# EasyEDA Pro project ProPrj_TBHandheld_2025-05-05.epro

# Schematic Schematic1
Board Name: Board1; Create Date: 2025-03-19; Page Name: P1; Project Name: ESP8266 Console; Schematic Name: Schematic1; Update Date: 2025-03-19; Company: EasyEDA.com; Page Size: A4; Version: V1.0
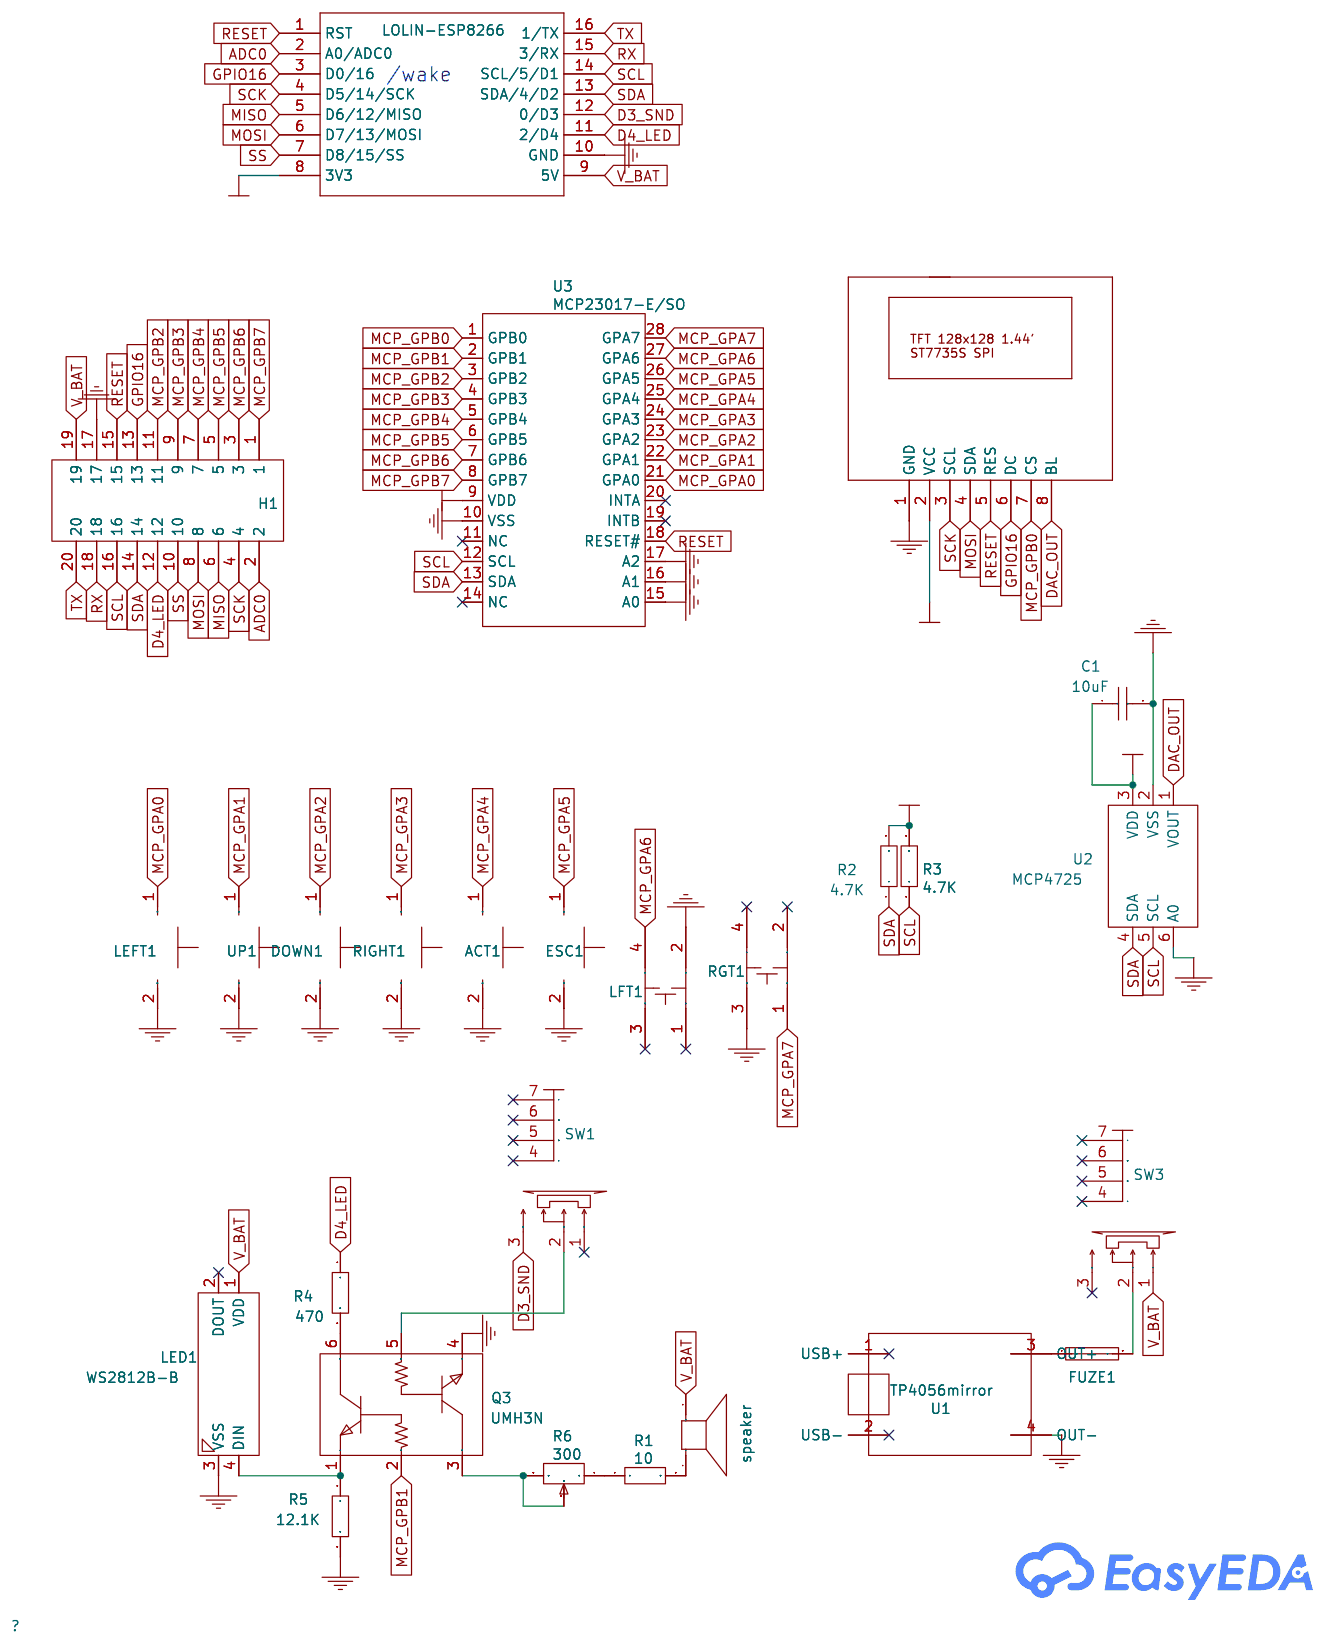
[diagram p0: schematic sheet]

## Parts
ACT1  SKPMAPE010  [KEY-SMD_2P-L6.0-W6.0-P6.00]
C1  10uF  [C0805]
DOWN1  SKPMAPE010  [KEY-SMD_2P-L6.0-W6.0-P6.00]
ESC1  SKPMAPE010  [KEY-SMD_2P-L6.0-W6.0-P6.00]
ESP8266  LOLIN-ESP8266  [WEMOS_D1_MINI_BOARD]
FUZE1  fuze  [F0805]
H1  header 10*2 45grad  [HDR-TH_20P-P2.54-H-F-R2-C10-S2.54-W10.2]
LCD1  LCD TFT 1.44' 128x128  [TFT1,44_SPI_128X128_ST7735S]
LED1  WS2812B-B  [LED-SMD_4P-L5.0-W5.0-TL_WS2812B-B]
LEFT1  SKPMAPE010  [KEY-SMD_2P-L6.0-W6.0-P6.00]
LFT1  SKSCLDE010  [KEY-SMD_4P-SKSCLXX010]
Q3  UMH3N  [SC-70-6_L2.2-W1.3-P0.65-LS2.1-BR]
R1  10  [R0805]
R2  4.7K  [R0805]
R3  4.7K  [R0805]
R4  470  [R0805]
R5  12.1K  [R0805]
R6  300  [RES-ADJ-SMD_VG039NCH]
RGT1  SKSCLDE010  [KEY-SMD_4P-SKSCLXX010]
RIGHT1  SKPMAPE010  [KEY-SMD_2P-L6.0-W6.0-P6.00]
SP1  speaker  [SPEAKER_RS3]
SW1  SSSS811101  [SW-TH_SSSS811101]
SW3  SSSS811101  [SW-TH_SSSS811101]
U1  TP4056mirror  [TP4056MIRROR6]
U2  MCP4725  [SOT-23-6_L2.9-W1.6-P0.95-LS2.8-BR]
U3  MCP23017-E/SO  [SOIC-28_L18.0-W7.5-P1.27-LS10.3-BL]
UP1  SKPMAPE010  [KEY-SMD_2P-L6.0-W6.0-P6.00]

## Library data of the parts
ACT1 DOWN1 ESC1 LEFT1 RIGHT1 UP1 = SKPMAPE010: Supplier: LCSC; Manufacturer: ALPS; Supplier Part: C110292; spicePre: S
C1 = CC0805ZKY5V6BB106: Supplier: LCSC; Manufacturer: YAGEO; Supplier Part: C88484; nameAlias: Capacitance; spicePre: C
ESP8266 = LOLIN-ESP8266: Supplier Part: D1 mini; Manufacturer: LOLIN / WeMos; sourceId: YemgaslDx; timeStamp: 1474924859; spicePre: U; spiceSymbolName: WEMOS D1
FUZE1 = FSMD050-0805-R: Supplier: LCSC; Supplier Part: C181350; Manufacturer: Fuzetec Tech; JLCPCB Part Class: Extended Part; Contributor: LCSC; spicePre: F
H1 = 220R-2*10P H=8.5MM Ytype Gold-plated black: Supplier: LCSC; Manufacturer: Ckmtw; Supplier Part: C124406; JLCPCB Part Class: Extended Part; Contributor: LCSC; spicePre: H
LCD1 = LCD TFT 1.44' 128x128: Contributor: roman.sokolov; spicePre: L; spiceSymbolName: 1.44_LCD-TFT(128x128)_ST7735S_SPI
LED1 = WS2812B-B: Supplier: LCSC; Manufacturer: Worldsemi; Supplier Part: C114586; JLCPCB Part Class: Extended Part; Contributor: LCSC; spicePre: L
LFT1 RGT1 = SKSCLDE010: Supplier: LCSC; Manufacturer: ALPS; Supplier Part: C115362; spicePre: S
Q3 = UMH3N: Supplier: LCSC; Manufacturer: CJ; image: //image.lceda.cn/szlcsc/C62892.jpg; Supplier Part: C62892; JLCPCB Part Class: Extended Part; spicePre: Q
R1 = RMC0805105%N: Supplier: LCSC; Supplier Part: C269725; Manufacturer: Tyohm; JLCPCB Part Class: Extended Part; nameAlias: Resistance (Ohms); Contributor: LCSC; spicePre: R
R2 R3 = RMC08054.7K5%N: Supplier: LCSC; Supplier Part: C269733; Manufacturer: Tyohm; JLCPCB Part Class: Extended Part; nameAlias: Resistance (Ohms); Contributor: LCSC; spicePre: R
R4 = RMC08054701%N: Supplier: LCSC; Supplier Part: C269542; Manufacturer: Tyohm; JLCPCB Part Class: Extended Part; nameAlias: Resistance (Ohms); Contributor: LCSC; spicePre: R
R5 = RMC080512.1K1%N: Supplier: LCSC; Supplier Part: C325797; Manufacturer: Tyohm; nameAlias: Resistance (Ohms); Contributor: LCSC; spicePre: R
R6 = VG039NCHXTB301: Supplier: LCSC; Manufacturer: HDK; Supplier Part: C128553; JLCPCB Part Class: Extended Part; nameAlias: Resistance (Ohms); spicePre: R
SP1 = speaker: Contributor: roman.sokolov; spicePre: S; spiceSymbolName: SPEAKER_RS
SW1 SW3 = SSSS811101: Supplier: LCSC; Manufacturer: ALPS; Supplier Part: C109335; spicePre: S
U1 = TP4056mirror: Contributor: roman.sokolov; spicePre: U
U2 = MCP4725A0T-E/CH: Supplier: LCSC; Manufacturer: MICROCHIP; Supplier Part: C144198; JLCPCB Part Class: Extended Part; Contributor: LCSC; spicePre: U
U3 = MCP23017-E/SO: Supplier: LCSC; Manufacturer: MICROCHIP; Supplier Part: C47023; JLCPCB Part Class: Extended Part; Contributor: LCSC; spicePre: U

## Nets
GND: ACT1.2 C1.2 DOWN1.2 ESC1.2 ESP8266.10(GND) H1.17 LCD1.1(GND) LED1.3(VSS) LEFT1.2 LFT1.2 Q3.4(E) R5.2 RGT1.3 RIGHT1.2 U1.4(OUT-) U2.2(VSS) U2.6(A0) U3.10(VSS) U3.15(A0) U3.16(A1) U3.17(A2) UP1.2
VCC: C1.1 ESP8266.8(3V3) LCD1.2(VCC) R2.2 R3.2 U2.3(VDD) U3.9(VDD)
ADC0: ESP8266.2(A0/ADC0) H1.2
D3_SND: ESP8266.12(0/D3) SW1.3
D4_LED: ESP8266.11(2/D4) H1.12 R4.1
DAC_OUT: LCD1.8(BL) U2.1(VOUT)
GPIO16: ESP8266.3(D0/16) H1.13 LCD1.6(DC)
MCP_GPA0: LEFT1.1 U3.21(GPA0)
MCP_GPA1: U3.22(GPA1) UP1.1
MCP_GPA2: DOWN1.1 U3.23(GPA2)
MCP_GPA3: RIGHT1.1 U3.24(GPA3)
MCP_GPA4: ACT1.1 U3.25(GPA4)
MCP_GPA5: ESC1.1 U3.26(GPA5)
MCP_GPA6: LFT1.4 U3.27(GPA6)
MCP_GPA7: RGT1.1 U3.28(GPA7)
MCP_GPB0: LCD1.7(CS) U3.1(GPB0)
MCP_GPB1: Q3.2(B) U3.2(GPB1)
MCP_GPB2: H1.11 U3.3(GPB2)
MCP_GPB3: H1.9 U3.4(GPB3)
MCP_GPB4: H1.7 U3.5(GPB4)
MCP_GPB5: H1.5 U3.6(GPB5)
MCP_GPB6: H1.3 U3.7(GPB6)
MCP_GPB7: H1.1 U3.8(GPB7)
MISO: ESP8266.5(D6/12/MISO) H1.6
MOSI: ESP8266.6(D7/13/MOSI) H1.8 LCD1.4(SDA)
RESET: ESP8266.1(RST) H1.15 LCD1.5(RES) U3.18(RESET#)
RX: ESP8266.15(3/RX) H1.18
SCK: ESP8266.4(D5/14/SCK) H1.4 LCD1.3(SCL)
SCL: ESP8266.14(SCL/5/D1) H1.16 R3.1 U2.5(SCL) U3.12(SCL)
SDA: ESP8266.13(SDA/4/D2) H1.14 R2.1 U2.4(SDA) U3.13(SDA)
SS: ESP8266.7(D8/15/SS) H1.10
TX: ESP8266.16(1/TX) H1.20
V_BAT: ESP8266.9(5V) H1.19 LED1.1(VDD) SP1.+ SW3.1
Net-(FUZE1-1): FUZE1.1 U1.3(OUT+)
Net-(FUZE1-2): FUZE1.2 SW3.2
Net-(LED1-4): LED1.4(DIN) Q3.1(E) R5.1
Q3_3: Q3.3(C) R6.2 R6.3
Q3_5: Q3.5(B) SW1.2
Q3_6: Q3.6(C) R4.2
R1_1: R1.1 R6.1
R1_2: R1.2 SP1.-

Not connected (* = marked no-connect by the designer): LED1 2(DOUT)*; LFT1 1* 3*; RGT1 2* 4*; SW1 1* 4* 5* 6* 7*; SW3 3* 4* 5* 6* 7*; U1 1(USB+)* 2(USB-)*; U3 11(NC)* 14(NC)* 19(INTB)* 20(INTA)*

## Notes on the sheet
- /wake

# Board Board
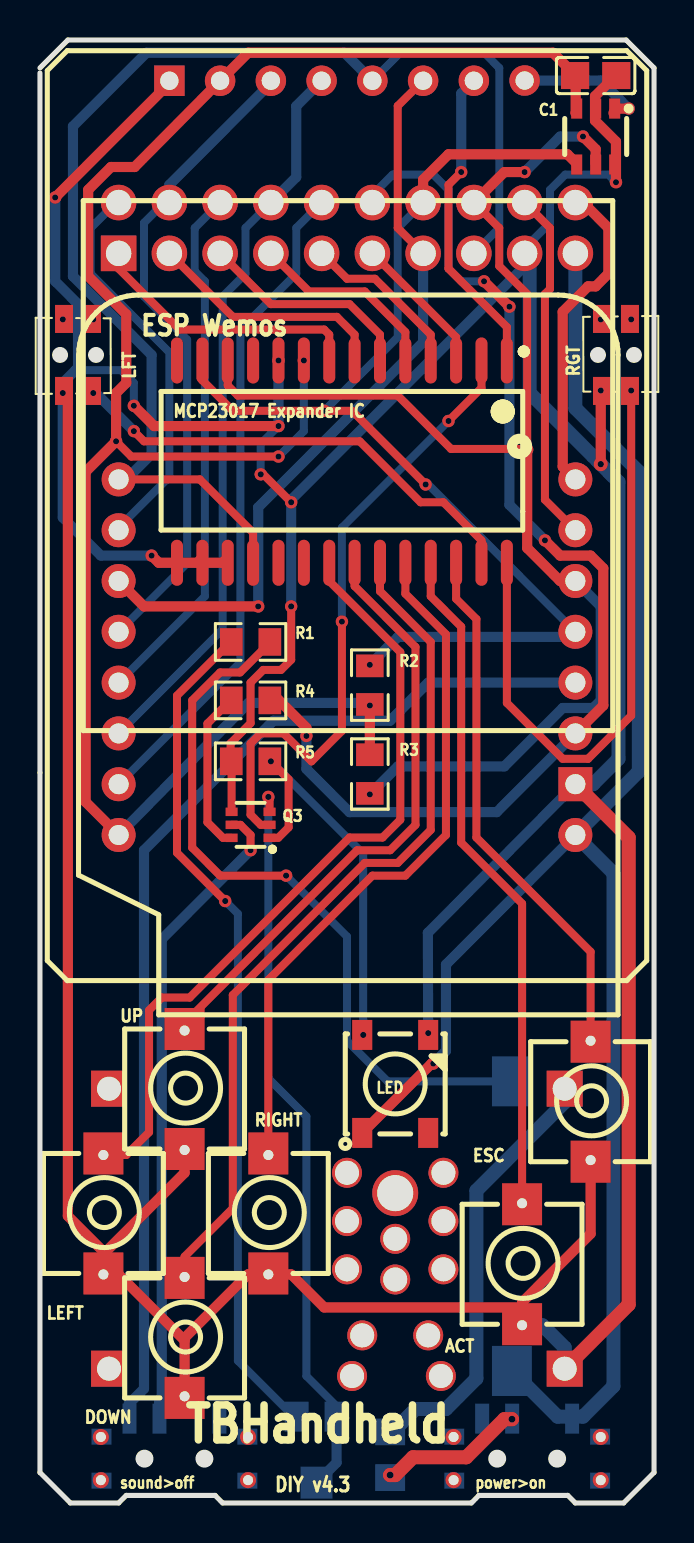
[diagram p1: board, top side]
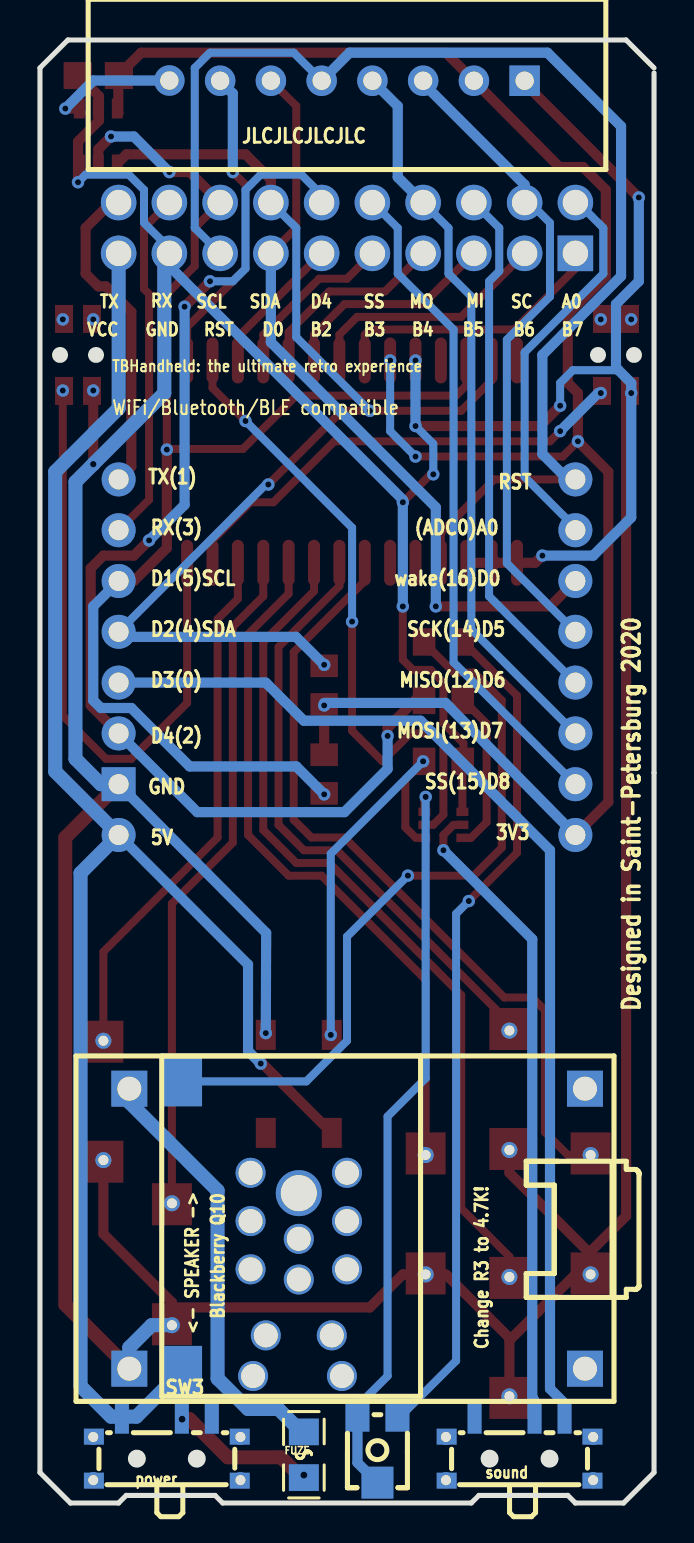
[diagram p2: board, bottom side, seen from below]

Outline 30.73 x 73.15 mm; copper layers: Top Layer, Bottom Layer. Coordinates in mm from the lower left corner of the outline.
Outline path: 0,71.76 1.4,73.15 29.34,73.15 30.73,71.76 30.73,1.52 29.21,0 26.8,0 26.42,0.38 21.97,0.38 21.59,0 9.14,0 8.76,0.38 4.32,0.38 3.94,0 1.52,0 0,1.52 0,71.5
Stack: Top Layer 0.035mm / Dielectric1 1.51mm FR4 er 4.5 / Bottom Layer 0.035mm

## Design rules (mm)
template: JLCPCB Capability(Two Layers Board)
spacing copperThickness1oz (default): track to track 0.102, other pairs 0.152 to 0.3
spacing copperThickness2oz: track to track 0.203, other pairs 0.152 to 0.3
track width copperThickness1oz (default): min 0.127, default 0.254, max 2.54
track width copperThickness2oz: min 0.203, default 0.254, max 2.54
differential pair differentialPair (default): width min 0.127, default 0.254, max 2.54; gap min 0.152, default 0.152
via viaSize (default): diameter min 0.5, default 0.61, max 10; hole min 0.3, default 0.305, max 6.3

## Placement (name value [footprint] x y rotation side)
ACT  SKPMAPE010  [KEY-SMD_2P-L6.0-W6.0-P6.00]  24.13 11.94 270 top
C1  10uF  [C0805]  27.81 71.37 0 top
DOWN  SKPMAPE010  [KEY-SMD_2P-L6.0-W6.0-P6.00]  7.24 8.26 270 top
ESC  SKPMAPE010  [KEY-SMD_2P-L6.0-W6.0-P6.00]  27.56 20.07 270 top
ESP8266  LOLIN-ESP8266  [WEMOS_D1_MINI_BOARD]  3.94 33.4 0 top
FUZE  fuze  [F0805]  17.53 2.41 270 bottom
H1  header 10*2 45grad  [HDR-TH_20P-P2.54-H-F-R2-C10-S2.54-W10.2]  15.37 63.75 0 bottom
LCD1  LCD TFT 1.44' 128x128  [TFT1,44_SPI_128X128_ST7735S]  15.37 71.12 0 top
LED  WS2812B-B  [LED-SMD_4P-L5.0-W5.0-TL_WS2812B-B]  17.78 20.95 90 top
LEFT  SKPMAPE010  [KEY-SMD_2P-L6.0-W6.0-P6.00]  3.18 14.48 270 top
LFT  SKSCLDE010  [KEY-SMD_4P-SKSCLXX010]  1.91 57.4 270 top
NOREF  -  [Pad_e538]  3.18 17.4 0 top
NOREF#2  -  [Pad_e568]  28.07 1.14 0 top
NOREF#3  -  [Pad_e552]  16.13 8.38 0 top
NOREF#4  -  [Pad_e561]  20.7 3.3 0 top
NOREF#5  -  [Pad_e560]  20.19 14.1 0 top
NOREF#6  -  [Pad_e562]  20.7 1.14 0 top
NOREF#7  -  [Pad_e563]  24.13 8.89 0 top
NOREF#8  -  [Pad_e553]  17.78 13.21 0 top
NOREF#9  -  [Pad_e565]  27.56 17.15 0 top
NOREF#10  -  [Pad_e567]  28.07 3.3 0 top
NOREF#11  -  [Pad_e537]  3.05 3.3 0 top
NOREF#12  -  [Pad_e550]  15.37 16.51 0 top
NOREF#13  -  [Pad_e556]  19.43 8.38 0 top
NOREF#14  -  [Pad_e551]  15.62 6.35 0 top
NOREF#15  -  [Pad_e557]  20.07 6.35 0 top
NOREF#16  -  [Pad_e558]  20.19 11.68 0 top
NOREF#17  -  [Pad_e566]  27.56 23.11 0 top
NOREF#18  -  [Pad_e540]  7.24 11.3 0 top
NOREF#19  -  [Pad_e542]  7.24 5.33 0 top
NOREF#20  -  [Pad_e564]  24.13 14.99 0 top
NOREF#21  -  [Pad_e549]  15.37 11.68 0 top
NOREF#22  -  [Pad_e543]  7.24 17.65 0 top
NOREF#23  -  [Pad_e546]  11.43 11.43 0 top
NOREF#24  -  [Pad_e547]  11.43 17.4 0 top
NOREF#25  -  [Pad_e541]  7.24 23.62 0 top
NOREF#26  -  [Pad_e554]  17.78 15.49 0 top
NOREF#27  -  [Pad_e548]  15.37 14.1 0 top
NOREF#28  -  [Pad_e539]  3.18 11.43 0 top
NOREF#29  -  [Pad_e545]  10.41 3.3 0 top
NOREF#30  -  [Pad_e559]  20.19 16.51 0 top
NOREF#31  -  [Pad_e555]  17.78 11.18 0 top
NOREF#32  -  [Pad_e536]  3.05 1.14 0 top
NOREF#33  -  [Pad_e544]  10.41 1.14 0 top
Q3  UMH3N  [SC-70-6_L2.2-W1.3-P0.65-LS2.1-BR]  10.54 33.91 0 top
R1  10  [R0805]  10.54 43.05 0 top
R2  4.7K  [R0805]  16.51 40.89 270 top
R3  4.7K  [R0805]  16.51 36.45 90 top
R4  470  [R0805]  10.54 40.13 180 top
R5  12.1K  [R0805]  10.54 37.08 180 top
R6  300  [RES-ADJ-SMD_VG039NCH]  13.84 2.67 90 bottom
RGT  SKSCLDE010  [KEY-SMD_4P-SKSCLXX010]  28.83 57.4 90 top
RIGHT  SKPMAPE010  [KEY-SMD_2P-L6.0-W6.0-P6.00]  11.43 14.48 270 top
SP1  speaker  [SPEAKER_RS3]  18.03 13.21 180 bottom
SW1  SSSS811101  [SW-TH_SSSS811101]  6.73 2.67 180 bottom
SW3  SSSS811101  [SW-TH_SSSS811101]  24.38 2.67 180 bottom
U1  TP4056mirror  [TP4056MIRROR6]  14.86 13.72 90 bottom
U2  MCP4725  [SOT-23-6_L2.9-W1.6-P0.95-LS2.8-BR]  27.81 68.33 90 top
U3  MCP23017-E/SO  [SOIC-28_L18.0-W7.5-P1.27-LS10.3-BL]  15.11 52.07 180 top
UP  SKPMAPE010  [KEY-SMD_2P-L6.0-W6.0-P6.00]  7.24 20.7 270 top

## Footprints (pads in the part's own frame, mm; a bottom-side part is the same pattern mirrored in y, then rotated)
C0805
  rect 1.41x1.35 smd: 1(-1.03,0) 2(1.03,0)
F0805
  rect 1.335x1.5 smd: 1(-1.143,0) 2(1.143,0)
HDR-TH_20P-P2.54-H-F-R2-C10-S2.54-W10.2
  rect 1.778x1.778 hole 1.27: 1(-11.43,1.27)
  round 1.778 hole 1.27: 2(-11.43,-1.27) 3(-8.89,1.27) 4(-8.89,-1.27) 5(-6.35,1.27) 6(-6.35,-1.27) 7(-3.81,1.27) 8(-3.81,-1.27) 9(-1.27,1.27) 10(-1.27,-1.27) 11(1.27,1.27) 12(1.27,-1.27) 13(3.81,1.27) 14(3.81,-1.27) 15(6.35,1.27) 16(6.35,-1.27) 17(8.89,1.27) 18(8.89,-1.27) 19(11.43,1.27) 20(11.43,-1.27)
KEY-SMD_2P-L6.0-W6.0-P6.00
  rect 2.1x2 smd: 1(-3,0) 2(3,0)
KEY-SMD_4P-SKSCLXX010
  rect 1.4x0.9 smd: 1(-1.8,-0.7) 2(1.8,-0.7) 3(-1.8,0.7) 4(1.8,0.7)
LED-SMD_4P-L5.0-W5.0-TL_WS2812B-B
  rect 1.5x1 smd: 1(-2.45,1.65) 2(-2.45,-1.65) 3(2.45,-1.65) 4(2.45,1.65)
Pad_e536
  round 0.8 hole 0.5: 3(0,0)
Pad_e537
  round 0.8 hole 0.5: 3(0,0)
Pad_e538
  round 0.8 hole 0.5: 3(0,0)
Pad_e539
  round 0.8 hole 0.5: 3(0,0)
Pad_e540
  round 0.8 hole 0.5: 3(0,0)
Pad_e541
  round 0.8 hole 0.5: 3(0,0)
Pad_e542
  round 0.8 hole 0.5: 3(0,0)
Pad_e543
  round 0.8 hole 0.5: 3(0,0)
Pad_e544
  round 0.8 hole 0.5: 3(0,0)
Pad_e545
  round 0.8 hole 0.5: 3(0,0)
Pad_e546
  round 0.8 hole 0.5: 3(0,0)
Pad_e547
  round 0.8 hole 0.5: 3(0,0)
Pad_e548
  round 1.5 hole 1.2: 1(0,0)
Pad_e549
  round 1.5 hole 1.2: 1(0,0)
Pad_e550
  round 1.5 hole 1.2: 1(0,0)
Pad_e551
  round 1.5 hole 1.2: 1(0,0)
Pad_e552
  round 1.5 hole 1.2: 1(0,0)
Pad_e553
  round 1.5 hole 1.2: 1(0,0)
Pad_e554
  round 2.3 hole 1.8: 1(0,0)
Pad_e555
  round 1.5 hole 1.2: 1(0,0)
Pad_e556
  round 1.5 hole 1.2: 1(0,0)
Pad_e557
  round 1.5 hole 1.2: 1(0,0)
Pad_e558
  round 1.5 hole 1.2: 1(0,0)
Pad_e559
  round 1.5 hole 1.2: 1(0,0)
Pad_e560
  round 1.5 hole 1.2: 1(0,0)
Pad_e561
  round 0.8 hole 0.5: 3(0,0)
Pad_e562
  round 0.8 hole 0.5: 3(0,0)
Pad_e563
  round 0.8 hole 0.5: 3(0,0)
Pad_e564
  round 0.8 hole 0.5: 3(0,0)
Pad_e565
  round 0.8 hole 0.5: 3(0,0)
Pad_e566
  round 0.8 hole 0.5: 3(0,0)
Pad_e567
  round 0.8 hole 0.5: 3(0,0)
Pad_e568
  round 0.8 hole 0.5: 3(0,0)
R0805
  rect 1.133x1.377 smd: 1(-0.966,0) 2(0.966,0)
RES-ADJ-SMD_VG039NCH
  rect 1.5x1.2 smd: 1(1.65,-1) 3(1.65,1)
  rect 1.6x1.6 smd: 2(-1.65,0)
SC-70-6_L2.2-W1.3-P0.65-LS2.1-BR
  rect 0.6x0.42 smd: 1(0.95,-0.65) 2(0.95,0) 3(0.95,0.65) 4(-0.95,0.65) 5(-0.95,0) 6(-0.95,-0.65)
SOIC-28_L18.0-W7.5-P1.27-LS10.3-BL
  oval 0.6x2.3 smd: 1(-8.255,-5.058) 2(-6.985,-5.058) 3(-5.715,-5.058) 4(-4.445,-5.058) 5(-3.175,-5.058) 6(-1.905,-5.058) 7(-0.635,-5.058) 8(0.635,-5.058) 9(1.905,-5.058) 10(3.175,-5.058) 11(4.445,-5.058) 12(5.715,-5.058) 13(6.985,-5.058) 14(8.255,-5.058) 15(8.255,5.058) 16(6.985,5.058) 17(5.715,5.058) 18(4.445,5.058) 19(3.175,5.058) 20(1.905,5.058) 21(0.635,5.058) 22(-0.635,5.058) 23(-1.905,5.058) 24(-3.175,5.058) 25(-4.445,5.058) 26(-5.715,5.058) 27(-6.985,5.058) 28(-8.255,5.058)
SOT-23-6_L2.9-W1.6-P0.95-LS2.8-BR
  rect 1x0.55 smd: 1(1.4,-0.95) 2(1.4,0) 3(1.4,0.95) 4(-1.4,0.95) 5(-1.4,0) 6(-1.4,-0.95)
SPEAKER_RS3
  rect 2x2.5 smd: +(-5.588,-6.604) -(-5.588,7.874)
SW-TH_SSSS811101
  rect 0.7x1.5 smd: 1(-2.25,1.55) 2(0.75,1.55) 3(2.25,1.55)
  rect 1x0.8 smd: 4(-3.65,0.65) 5(3.65,0.65) 6(3.65,-1.55) 7(-3.65,-1.55)
TFT1,44_SPI_128X128_ST7735S
  rect 1.524x1.524 hole 0.914: 1(-8.89,-0.005)
  round 1.524 hole 0.914: 2(-6.351,-0.005) 3(-3.811,-0.005) 4(-1.271,-0.005) 5(1.269,-0.005) 6(3.809,-0.005) 7(6.349,-0.005) 8(8.891,0.005)
TP4056MIRROR6
  rect 1.8x1.8 hole 1.199: 1(7,-11.402) 2(-7,-11.402) 3(7,11.402) 4(-7,11.402)
WEMOS_D1_MINI_BOARD
  round 1.7 hole 1: 1(0,17.78) 2(0,15.24) 3(0,12.7) 4(0,10.16) 5(0,7.62) 6(0,5.08) 7(0,2.54) 8(0,0) 9(22.86,0) 11(22.86,5.08) 12(22.86,7.62) 13(22.86,10.16) 14(22.86,12.7) 15(22.86,15.24) 16(22.86,17.78)
  rect 1.7x1.7 hole 1: 10(22.86,2.54)

## Nets
GND: ACT.2 C1.2 DOWN.2 ESC.2 ESP8266.10 H1.17 LCD1.1 LED.3 LEFT.2 LFT.2 NOREF#7.3 NOREF#9.3 NOREF#19.3 NOREF#22.3 NOREF#23.3 NOREF#28.3 Q3.4 R5.2 RGT.3 RIGHT.2 U1.4 U2.2 U2.6 U3.10 U3.15 U3.16 U3.17 UP.2
VCC: C1.1 ESP8266.8 LCD1.2 R2.2 R3.2 U2.3 U3.9
ADC0: ESP8266.2 H1.2
D3_SND: ESP8266.12 SW1.3
D4_LED: ESP8266.11 H1.12 R4.1
DAC_OUT: LCD1.8 U2.1
FUZE_1: FUZE.1 U1.3
FUZE_2: FUZE.2 SW3.2
GPIO16: ESP8266.3 H1.13 LCD1.6
LED_4: LED.4 Q3.1 R5.1
MCP_GPA0: LEFT.1 NOREF.3 U3.21
MCP_GPA1: NOREF#25.3 U3.22 UP.1
MCP_GPA2: DOWN.1 NOREF#18.3 U3.23
MCP_GPA3: NOREF#24.3 RIGHT.1 U3.24
MCP_GPA4: ACT.1 NOREF#20.3 U3.25
MCP_GPA5: ESC.1 NOREF#17.3 U3.26
MCP_GPA6: LFT.4 U3.27
MCP_GPA7: RGT.1 U3.28
MCP_GPB0: LCD1.7 U3.1
MCP_GPB1: Q3.2 U3.2
MCP_GPB2: H1.11 U3.3
MCP_GPB3: H1.9 U3.4
MCP_GPB4: H1.7 U3.5
MCP_GPB5: H1.5 U3.6
MCP_GPB6: H1.3 U3.7
MCP_GPB7: H1.1 U3.8
MISO: ESP8266.5 H1.6
MOSI: ESP8266.6 H1.8 LCD1.4
Q3_3: Q3.3 R6.2 R6.3
Q3_5: Q3.5 SW1.2
Q3_6: Q3.6 R4.2
R1_1: R1.1 R6.1
R1_2: R1.2 SP1.-
RESET: ESP8266.1 H1.15 LCD1.5 U3.18
RX: ESP8266.15 H1.18
SCK: ESP8266.4 H1.4 LCD1.3
SCL: ESP8266.14 H1.16 R3.1 U2.5 U3.12
SDA: ESP8266.13 H1.14 R2.1 U2.4 U3.13
SS: ESP8266.7 H1.10
TX: ESP8266.16 H1.20
V_BAT: ESP8266.9 H1.19 LED.1 SP1.+ SW3.1

Pads without a net: LED 2; LFT 1 3; NOREF#2 3; NOREF#3 1; NOREF#4 3; NOREF#5 1; NOREF#6 3; NOREF#8 1; NOREF#10 3; NOREF#11 3; NOREF#12 1; NOREF#13 1; NOREF#14 1; NOREF#15 1; NOREF#16 1; NOREF#21 1; NOREF#26 1; NOREF#27 1; NOREF#29 3; NOREF#30 1; NOREF#31 1; NOREF#32 3; NOREF#33 3; RGT 2 4; SW1 1 4 5 6 7; SW3 3 4 5 6 7; U1 1 2; U3 11 14 19 20

## Via types
v1: diameter 0.62, hole 0.305, Top Layer to Bottom Layer, 36 vias
v2: diameter 0.62, hole 0.31, Top Layer to Bottom Layer, 10 vias
v3: diameter 0.7, hole 0.32, Top Layer to Bottom Layer, 1 via
v4: diameter 0.7, hole 0.35, Top Layer to Bottom Layer, 2 vias

## Routing (per net, layer and track width the routed paths; a pad name or vN(x,y) marks a point on that pad's centre or on a via; arc(x,y) is an arc through that point)
GND: length 276
  Top Layer w0.4: v2(11.05,51.44) 11.18,51.44 v2(12.57,50.04) ; Q3.4 9.59,37.03 9.54,37.08 9.54,37.99 10.54,38.99 10.54,41.02 11.18,41.66 12.06,41.66 12.57,42.16 v2(12.57,44.83)
  Top Layer w0.508: 3.18,12.45 3.18,12.57 1.4,14.35 1.4,55.25 v1(1.14,55.5) ; 3.18,12.45 7.24,16.51 NOREF#22.3 ; 3.18,12.45 NOREF#28.3 3.94,11.43 7.24,8.13 ; 6.35,70.99 6.35,70.87 v1(0.76,65.28) ; 9.4,47.27 9.14,47.01 8.13,47.01 ; v1(28.83,66.04) 28.83,68.07 27.78,69.12 27.78,70.34 28.81,71.37 ; 7.24,8.13 NOREF#19.3 ; 7.24,8.13 7.24,8.26 10.41,11.43 NOREF#23.3 12.57,11.43 14.22,9.78 24.13,9.78 ; 19.28,23.32 19.28,23.34 v1(19.43,23.5) ; NOREF#9.3 27.56,13.46 24.13,10.03 24.13,9.78 ; 24.13,9.78 NOREF#7.3 ; RGT.3 28.09,55.6 v1(28.07,55.63) v3(28.07,51.94) ; v1(11.94,53.85) 5.72,53.85 v1(4.7,54.86) ; v1(5.59,47.37) 5.95,47.01 U3.15 7.87,47.01 8.13,47.27
  Top Layer w0.7: U1.4 29.46,9.92 29.46,33.27 ESP8266.10
  Bottom Layer w0.4: 1.78,56.64 4.06,56.64 4.7,56.01 v1(4.7,54.86) ; v2(11.05,51.44) 11.05,52.96 v1(11.94,53.85) ; v1(28.83,66.04) 28.45,66.42 26.29,66.42 25.53,65.66 25.53,64.01 24.26,62.74 H1.17
  Bottom Layer w0.508: v1(5.59,47.37) 3.05,47.37 1.14,49.28 v1(1.14,55.5) 1.14,56.01 1.91,56.77 1.91,59.94 0.76,61.09 v1(0.76,65.28) ; v1(19.43,23.5) 19.41,28.51 ESP8266.10 ; H1.17 24.26,61.85 12.57,50.17 v2(12.57,50.04) v2(12.57,44.83) ; v1(11.94,57.13) v1(11.94,53.85)
  Bottom Layer w0.7: ESP8266.10 27.69,35.94 28.96,37.21 28.96,51.05 v3(28.07,51.94) 24.51,55.5 24.51,62.23 H1.17 ; U1.4 26.26,7.78 25.15,8.89 NOREF#7.3
VCC: length 95.7
  Top Layer w0.4: v1(3.81,53.09) 4.57,52.32 v1(11.94,52.32)
  Top Layer w0.508: ESP8266.8 2.29,35.05 2.29,51.56 v1(3.81,53.09) 3.81,55.5 4.32,56.01 4.32,59.44 2.41,61.34 2.41,65.66 3.56,66.8 4.74,66.8 LCD1.2 10.42,72.52 25.67,72.52 26.81,71.37 26.81,69.51 26.8,69.5 ; 16.51,40.02 16.51,40.01 ; 16.51,39.89 16.51,37.45
  Bottom Layer w0.4: v1(11.94,52.32) 13.21,53.59 v1(13.21,57.13)
  Bottom Layer w0.508: ESP8266.8 10.44,40.01 16.51,40.01
  vias: v1(16.51,39.88)
(no net):
  vias: v1(1.14,59.18) v1(2.67,59.18) v1(28.07,59.18) v1(29.59,59.18)
ADC0: length 19.7
  Bottom Layer w0.4: ESP8266.2 3.94,48.77 6.48,51.31 6.48,57.53 2.54,61.47 2.54,63.75 3.81,65.02 H1.2
D3_SND: length 54
  Bottom Layer w0.508: ESP8266.12 19.43,41.02 17.53,39.12 11.68,39.12 5.21,32.64 5.21,5.72 4.45,4.95 4.45,4.06
D4_LED: length 57.9
  Top Layer w0.508: ESP8266.11 28.19,39.88 28.19,46.74 27.56,47.37 26.03,47.37 v1(25.27,48.13) ; 11.56,40.13 11.91,40.18 13.34,38.76 v1(13.34,38.35) ; v1(22.23,61.09) v1(23.5,59.82)
  Bottom Layer w0.4: H1.12 16.64,65.41 17.65,66.42 19.69,66.42 20.45,65.66 20.45,61.72 21.08,61.09 v1(22.23,61.09)
  Bottom Layer w0.508: v1(25.27,48.13) 23.5,49.91 v1(23.5,59.82) ; v1(13.34,38.35) 13.34,36.7 15.49,34.54 22.86,34.54 ESP8266.11
DAC_OUT: length 6.6
  Top Layer w0.508: v1(29.46,69.72) 28.92,69.72 28.7,69.5
  Bottom Layer w0.508: v1(29.46,69.72) 28.06,71.13 LCD1.8
FUZE_1: length 21.8
  Bottom Layer w0.7: U1.3 26.26,20.04 21.84,15.62 21.84,6.22 20.32,4.7 18.8,4.7 17.53,3.43
FUZE_2: length 7.3
  Top Layer w0.7: v4(17.53,1.4) 17.78,1.4 18.67,2.29 21.34,2.29 23.24,4.19 v4(23.62,4.19)
GPIO16: length 38.3
  Top Layer w0.4: H1.13 17.91,63.75 17.91,69.86 LCD1.6
  Top Layer w0.508: ESP8266.3 5.21,44.83 v1(10.92,44.83)
  Bottom Layer w0.508: H1.13 19.18,58.04 10.92,49.78 v1(10.92,44.83)
LED_4: length 20.4
  Top Layer w0.4: 11.49,33.26 11.92,33.26 12.45,33.78 12.45,36.18 11.54,37.08
  Bottom Layer w0.4: v2(11.56,37.08) 16.18,32.46 v2(16.18,23.4)
MCP_GPA0: length 39.7
  Top Layer w0.4: U3.21 14.48,46.1 18.03,42.55 18.03,34.16 17.15,33.27 15.49,33.27 7.49,25.27 6.1,25.27 5.46,24.64 5.46,18.54 4.32,17.4 NOREF.3
MCP_GPA1: length 30.4
  Top Layer w0.4: NOREF#25.3 7.24,24 15.88,32.64 17.53,32.64 18.8,33.91 18.8,42.8 15.75,45.85 15.75,47.01
MCP_GPA2: length 42.9
  Top Layer w0.4: 7.24,11.25 7.24,12.32 9.65,14.73 9.65,25.4 16.26,32 17.91,32 19.56,33.66 19.56,43.05 17.02,45.59 U3.23
MCP_GPA3: length 35.1
  Top Layer w0.4: U3.24 18.29,45.47 20.32,43.43 20.32,33.4 18.29,31.37 16.64,31.37 11.43,26.16 NOREF#24.3
MCP_GPA4: length 33.9
  Top Layer w0.4: NOREF#20.3 24.13,29.97 21.08,33.02 21.08,43.82 19.56,45.34 U3.25
MCP_GPA5: length 26.7
  Top Layer w0.4: NOREF#17.3 27.56,27.56 21.84,33.27 21.84,44.2 20.83,45.21 U3.26
MCP_GPA6: length 23.6
  Top Layer w0.4: v1(4.7,53.59) 5.21,53.09 16,53.09 19.05,50.04 20.19,50.04 22.1,48.13 U3.27
  Bottom Layer w0.508: v1(2.67,55.5) 2.79,55.5 v1(4.7,53.59)
MCP_GPA7: length 31.5
  Top Layer w0.4: U3.28 23.37,40.01 26.16,37.21 27.43,37.21 29.59,39.37 v1(29.59,55.63)
MCP_GPB0: length 15.7
  Top Layer w0.4: U3.1 23.37,58.8 20.45,61.72 20.45,65.91 v1(21.08,66.55)
  Bottom Layer w0.508: v1(21.08,66.55) 21.08,70.48 LCD1.7
MCP_GPB1: length 32.1
  Top Layer w0.4: Q3.2 11.05,33.91 10.54,34.42 10.54,37.97 11.05,38.48 12.19,38.48 13.59,37.08 15.11,38.61 v1(15.11,44.07) ; v1(20.45,54.1) 22.1,55.75 U3.2
  Bottom Layer w0.4: v1(20.45,54.1) 15.11,48.77 v1(15.11,44.07)
MCP_GPB2: length 7.1
  Top Layer w0.4: U3.3 20.83,58.29 H1.11
MCP_GPB3: length 8.4
  Top Layer w0.4: U3.4 19.56,58.42 16.76,61.21 15.37,61.21 H1.9
MCP_GPB4: length 9.8
  Top Layer w0.4: H1.7 13.46,60.58 16.26,60.58 18.29,58.55 U3.5
MCP_GPB5: length 11
  Top Layer w0.4: H1.5 11.56,59.94 15.49,59.94 17.02,58.42 U3.6
MCP_GPB6: length 12.2
  Top Layer w0.4: H1.3 9.65,59.31 14.86,59.31 15.75,58.42 15.75,57.13
MCP_GPB7: length 14
  Top Layer w0.4: U3.8 14.48,58.42 14.22,58.67 6.99,58.67 3.94,61.72 H1.1
MISO: length 26.5
  Bottom Layer w0.4: H1.6 7.75,63.75 7.75,61.6 8.25,61.09 8.25,45.34 ESP8266.5
MOSI: length 36.8
  Bottom Layer w0.4: H1.8 10.29,63.75 10.29,61.47 9.14,60.33 9.14,43.69 ESP8266.6
  Bottom Layer w0.508: H1.8 12.83,66.29 12.83,69.85 14.1,71.12
Q3_3: length 36.9
  Top Layer w0.4: Q3.3 11.49,35.25 v2(11.43,35.31)
  Bottom Layer w0.4: v2(11.43,35.31) 11.43,21.23 13.34,19.33 13.34,6.35 14.86,4.83 14.86,4.32
  Bottom Layer w0.508: R6.3 14.84,2.02 R6.2
Q3_5: length 32.2
  Top Layer w0.4: Q3.5 10.03,33.91 10.54,33.4 v1(10.54,32.64)
  Bottom Layer w0.508: 5.97,4.19 5.97,5.08 6.1,5.33 6.1,28.19 v1(10.54,32.64)
Q3_6: length 8.1
  Top Layer w0.4: 9.59,33.26 9.16,33.26 8.38,34.04 8.38,38.97 9.54,40.13
R1_1: length 42.4
  Top Layer w0.4: 9.54,43.05 6.86,40.37 6.86,32.51 v2(9.27,30.1)
  Bottom Layer w0.4: v2(9.27,30.1) 9.91,29.46 9.91,7.11 12.7,4.32 R6.1
R1_2: length 36.4
  Top Layer w0.4: v2(12.32,31.37) 9.02,31.37 7.62,32.77 7.62,40.13 9.02,41.53 10.02,41.53 11.54,43.05
  Bottom Layer w0.4: SP1.- 17.4,21.08 15.37,23.11 15.37,28.32 v2(12.32,31.37)
RESET: length 63.7
  Top Layer w0.4: ESP8266.1 8,51.18 10.67,48.51 U3.18
  Bottom Layer w0.4: 16.64,71.12 18.03,72.52 22.23,72.52 22.99,71.76 22.99,63.75 H1.15
  Bottom Layer w0.508: 16.64,71.12 15.24,72.52 5.33,72.52 1.65,68.83 1.65,61.34 5.59,57.4 5.59,52.45 4.32,51.18 ESP8266.1
RX: length 17.6
  Top Layer w0.4: H1.18 25.53,63.75 25.53,60.71 25.27,60.45 25.27,50.17 ESP8266.15
SCK: length 32.6
  Bottom Layer w0.4: H1.4 6.22,65.02 5.21,64.01 5.21,60.33 7.37,58.17 7.37,46.99 ESP8266.4
  Bottom Layer w0.508: H1.4 6.48,65.91 11.56,70.99 11.56,71.12
SCL: length 67.4
  Top Layer w0.4: U3.12 9.4,55.88 9.91,55.37 17.91,55.37 20.57,52.71 24.38,52.71 24.38,60.45 22.99,61.85 22.99,63.75 H1.16
  Top Layer w0.508: v1(24.38,52.67) 24.38,47.75 26.03,46.1 ESP8266.14 ; 27.81,66.98 27.81,67.69 v1(27.18,68.33) ; H1.16 23.24,66.55 v1(24.26,66.55) ; 16.51,35.45 v1(16.51,35.43)
  Bottom Layer w0.508: v1(27.18,68.33) 26.03,68.33 v1(24.26,66.55) ; v1(16.51,35.43) 17.91,36.83 23.24,36.83 26.16,39.75 27.69,39.75 28.07,40.13 28.07,44.83 ESP8266.14
SDA: length 58
  Top Layer w0.4: v2(19.3,50.93) 15.62,54.61 v2(14.22,54.61) 9.65,54.61 8.13,56.13 8.13,57.12
  Top Layer w0.508: 16.51,42.02 16.51,42.04 ; 26.86,66.98 26.4,67.44 20.45,67.44 19.18,66.17 H1.14
  Bottom Layer w0.4: ESP8266.13 19.43,50.93 v2(19.3,50.93) ; H1.14 17.91,63.75 17.91,58.29 v2(14.22,54.61)
  Bottom Layer w0.508: v1(16.51,41.91) 17.92,43.31 26.8,43.31 ESP8266.13
SS: length 33.3
  Bottom Layer w0.4: ESP8266.7 10.03,42.04 10.03,58.67 12.83,61.47 12.83,63.75 H1.10
TX: length 16.2
  Top Layer w0.508: ESP8266.16 26.16,51.82 26.16,59.56 27.43,60.83 27.81,60.83 28.45,61.47 28.45,63.75 27.18,65.02 H1.20
V_BAT: length 86.1
  Top Layer w0.508: v1(19.69,21.97) 19.6,21.97 LED.1
  Bottom Layer w0.508: ESP8266.9 20.32,26.92 20.32,22.61 v1(19.69,21.97)
  Bottom Layer w0.7: H1.19 26.8,54.74 29.97,51.56 29.97,36.58 ESP8266.9 28.7,31.5 28.7,5.84 27.18,4.32 25.91,4.32 SP1.+

## Text on the board
Bottom Silkscreen Layer: TBHandheld: the ultimate retro experience | power | sound | <- SPEAKER -> | Blackberry Q10 | A0 | B7 | B6 | SC | MI | B5 | B4 | MO | SS | B3 | D4 | B2 | D0 | SDA | RST | SCL | RX | GND | TX | VCC | Change R3 to 4.7K! | WiFi/Bluetooth/BLE compatible | 3V3 | SS(15)D8 | (ADC0)A0 | SCK(14)D5 | MISO(12)D6 | MOSI(13)D7 | wake(16)D0 | RX(3) | D1(5)SCL | D2(4)SDA | D3(0) | D4(2) | 5V | TX(1) | JLCJLCJLCJLC | Designed in Saint-Petersburg 2020
Top Silkscreen Layer: sound>off | power>on | MCP23017 Expander IC | DIY v4.3 | ESP Wemos | TBHandheld

# Board Case_Back
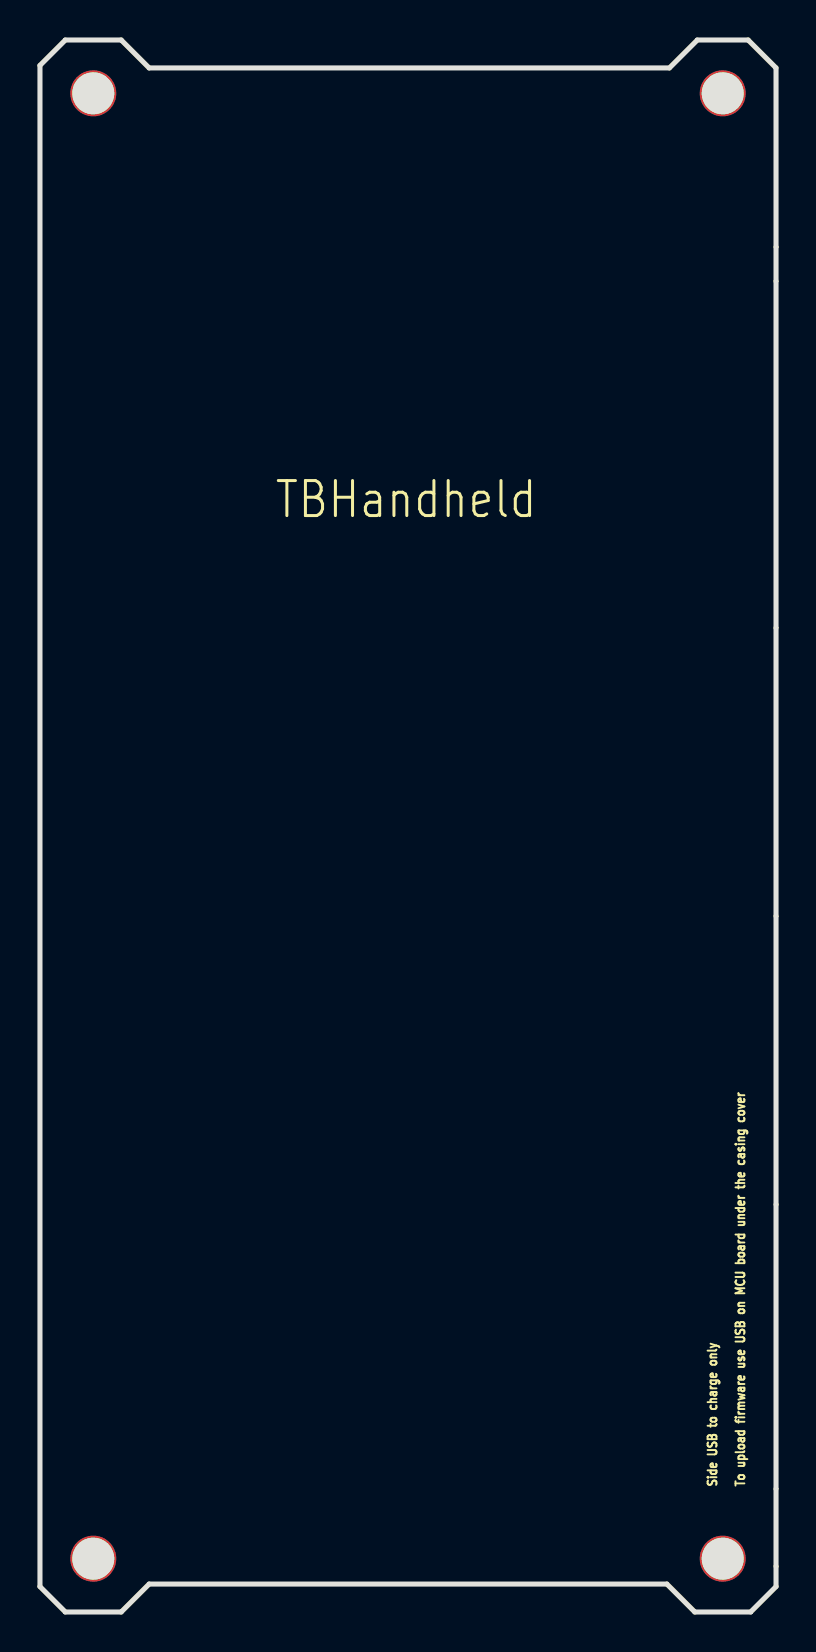
[diagram p3: board, top side]
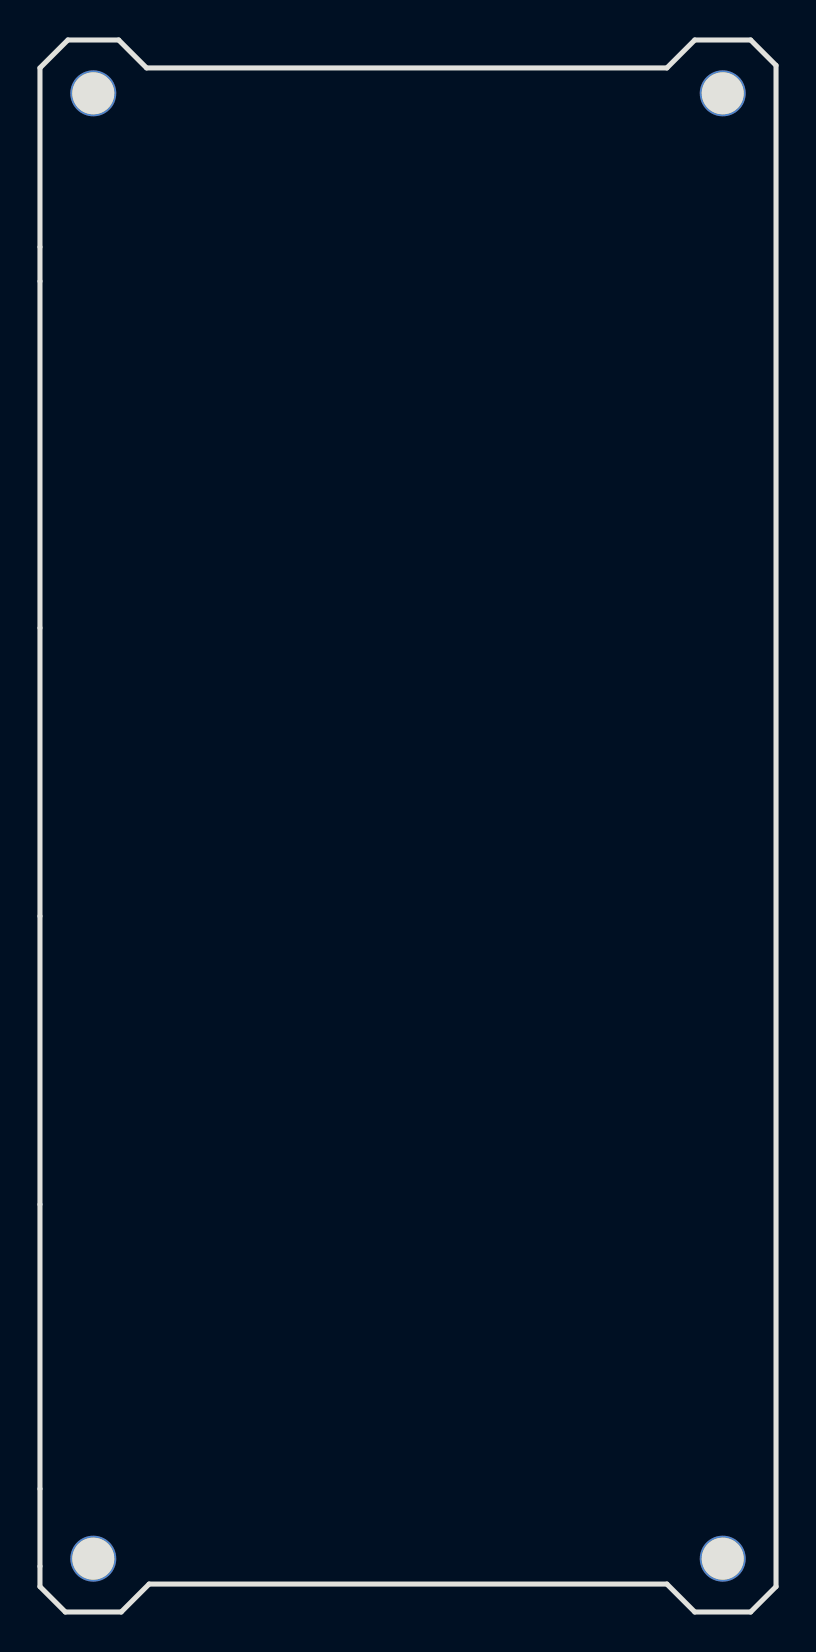
[diagram p4: board, bottom side, seen from below]

Outline 36.83 x 78.61 mm; copper layers: Top Layer, Bottom Layer. Coordinates in mm from the lower left corner of the outline.
Outline path: 0,77.34 0,1.27 1.27,0 4.06,0 5.46,1.4 31.37,1.4 32.77,0 35.56,0 36.83,1.27 36.83,77.22 35.43,78.61 32.89,78.61 31.5,77.22 5.46,77.22 4.06,78.61 1.27,78.61 0,77.34
Stack: Top Layer 0.035mm / Dielectric1 1.51mm FR4 er 4.5 / Bottom Layer 0.035mm

## Design rules (mm)
template: JLCPCB Capability(Two Layers Board)
spacing copperThickness1oz (default): track to track 0.102, other pairs 0.152 to 0.3
spacing copperThickness2oz: track to track 0.203, other pairs 0.152 to 0.3
track width copperThickness1oz (default): min 0.127, default 0.254, max 2.54
track width copperThickness2oz: min 0.203, default 0.254, max 2.54
differential pair differentialPair (default): width min 0.127, default 0.254, max 2.54; gap min 0.152, default 0.152
via viaSize (default): diameter min 0.5, default 0.61, max 10; hole min 0.3, default 0.305, max 6.3

## Placement (name value [footprint] x y rotation side)
NOREF  -  [Pad_e8]  34.16 75.95 0 top
NOREF#2  -  [Pad_e9]  34.16 2.67 0 top
NOREF#3  -  [Pad_e7]  2.67 75.95 0 top
NOREF#4  -  [Pad_e6]  2.67 2.67 0 top

## Footprints (pads in the part's own frame, mm; a bottom-side part is the same pattern mirrored in y, then rotated)
Pad_e6
  round 2.3 hole 2.1: 3(0,0)
Pad_e7
  round 2.3 hole 2.1: 3(0,0)
Pad_e8
  round 2.3 hole 2.1: 3(0,0)
Pad_e9
  round 2.3 hole 2.1: 3(0,0)

## Nets

Pads without a net: NOREF 3; NOREF#2 3; NOREF#3 3; NOREF#4 3

## Text on the board
Top Silkscreen Layer: Side USB to charge only | To upload firmware use USB on MCU board under the casing cover | TBHandheld

# Board Case_Front
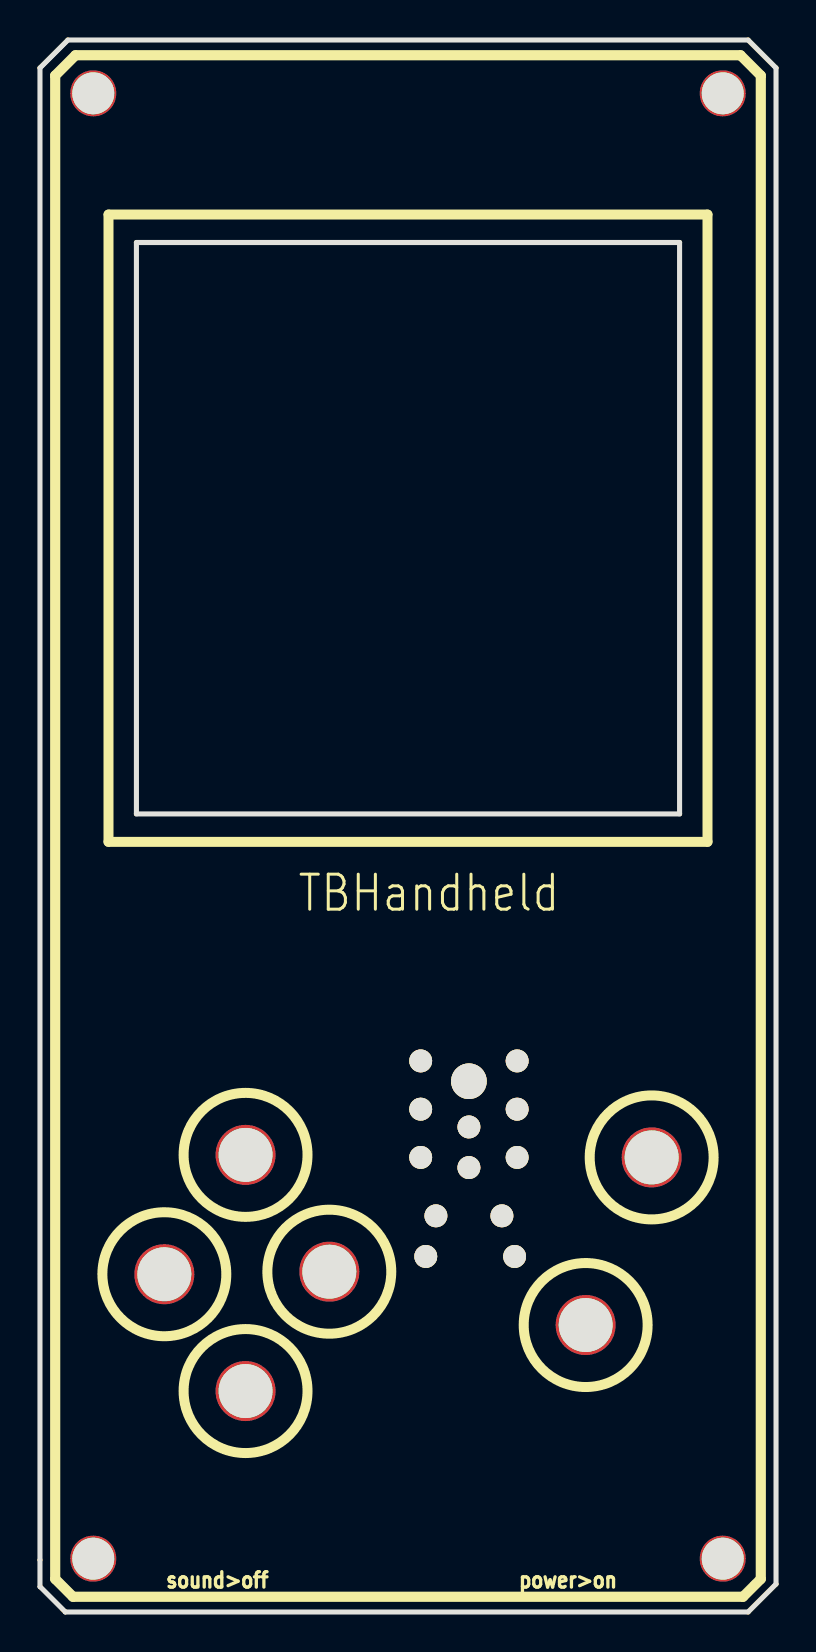
[diagram p5: board, top side]
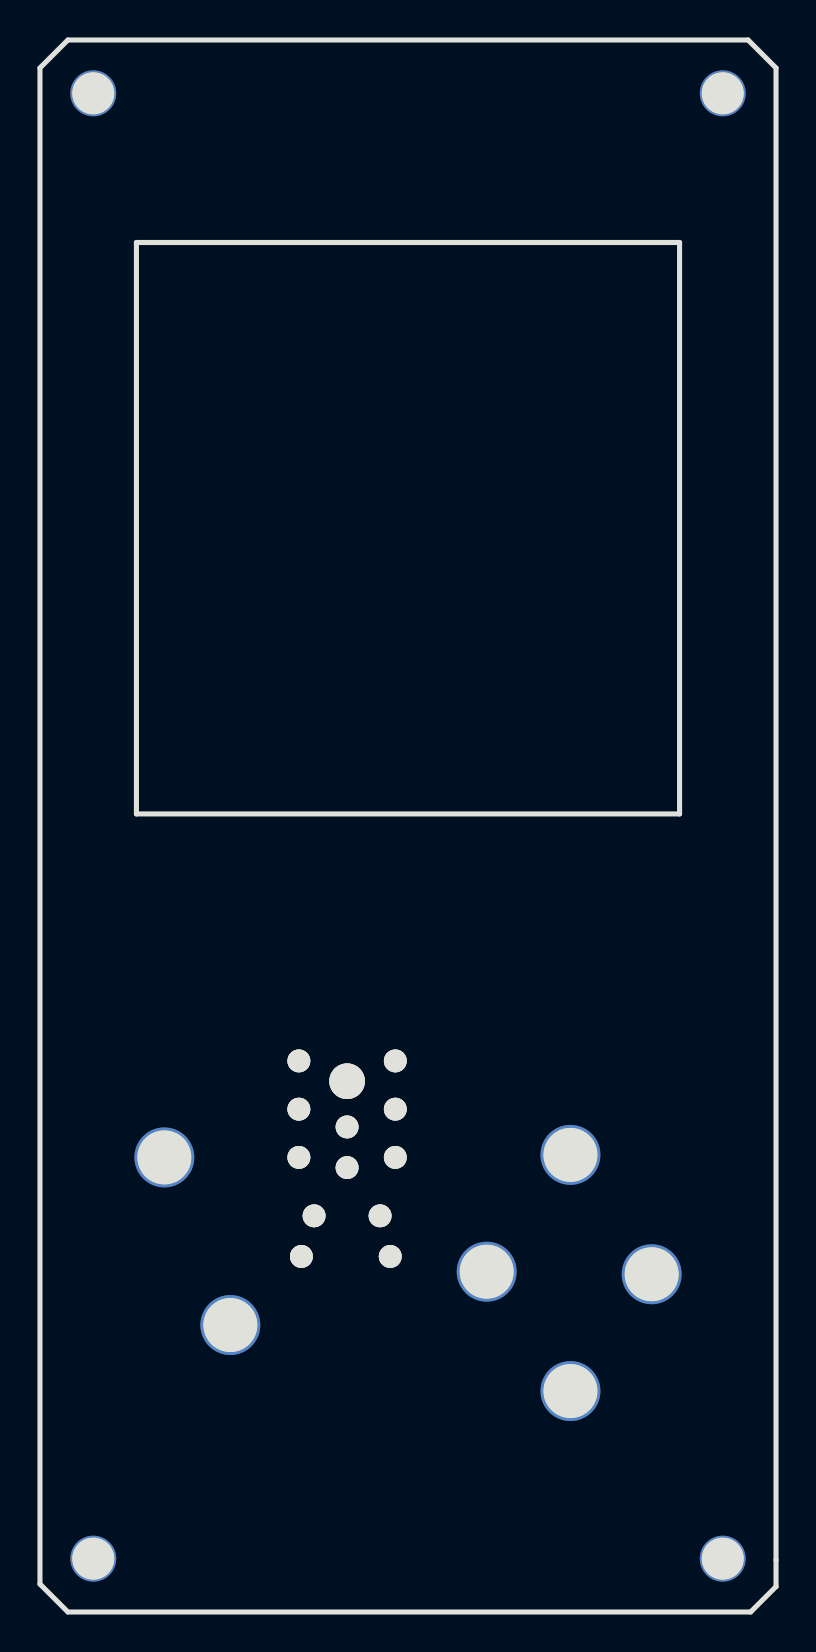
[diagram p6: board, bottom side, seen from below]

Outline 36.83 x 78.61 mm; copper layers: Top Layer, Bottom Layer. Coordinates in mm from the lower left corner of the outline.
Outline path: 0,77.22 1.4,78.61 35.43,78.61 36.83,77.22 36.83,1.4 35.43,0 1.27,0 0,1.27 0,77.22 ; 4.83,68.49 32,68.49 32,39.91 4.83,39.91 4.83,68.49
Stack: Top Layer 0.035mm / Dielectric1 1.51mm FR4 er 4.5 / Bottom Layer 0.035mm

## Design rules (mm)
template: JLCPCB Capability(Two Layers Board)
spacing copperThickness1oz (default): track to track 0.102, other pairs 0.152 to 0.3
spacing copperThickness2oz: track to track 0.203, other pairs 0.152 to 0.3
track width copperThickness1oz (default): min 0.127, default 0.254, max 2.54
track width copperThickness2oz: min 0.203, default 0.254, max 2.54
differential pair differentialPair (default): width min 0.127, default 0.254, max 2.54; gap min 0.152, default 0.152
via viaSize (default): diameter min 0.5, default 0.61, max 10; hole min 0.3, default 0.305, max 6.3

## Placement (name value [footprint] x y rotation side)
NOREF  -  [Pad_e24]  21.46 22.23 0 top
NOREF#2  -  [Pad_e33]  30.61 22.73 0 top
NOREF#3  -  [Pad_e25]  21.46 24.26 0 top
NOREF#4  -  [Pad_e35]  34.16 2.67 0 top
NOREF#5  -  [Pad_e30]  23.88 25.15 0 top
NOREF#6  -  [Pad_e21]  19.05 25.15 0 top
NOREF#7  -  [Pad_e14]  2.67 2.67 0 top
NOREF#8  -  [Pad_e17]  10.29 22.86 0 top
NOREF#9  -  [Pad_e18]  14.48 17.02 0 top
NOREF#10  -  [Pad_e31]  23.88 22.73 0 top
NOREF#11  -  [Pad_e19]  19.05 27.56 0 top
NOREF#12  -  [Pad_e29]  23.88 27.56 0 top
NOREF#13  -  [Pad_e27]  23.11 19.81 0 top
NOREF#14  -  [Pad_e16]  10.29 11.05 0 top
NOREF#15  -  [Pad_e22]  19.3 17.78 0 top
NOREF#16  -  [Pad_e23]  19.81 19.81 0 top
NOREF#17  -  [Pad_e26]  21.46 26.54 0 top
NOREF#18  -  [Pad_e15]  6.22 16.89 0 top
NOREF#19  -  [Pad_e28]  23.75 17.78 0 top
NOREF#20  -  [Pad_e20]  19.05 22.73 0 top
NOREF#21  -  [Pad_e34]  34.16 75.95 0 top
NOREF#22  -  [Pad_e13]  2.67 75.95 0 top
NOREF#23  -  [Pad_e32]  27.3 14.35 0 top

## Footprints (pads in the part's own frame, mm; a bottom-side part is the same pattern mirrored in y, then rotated)
Pad_e13
  round 2.3 hole 2.1: 3(0,0)
Pad_e14
  round 2.3 hole 2.1: 3(0,0)
Pad_e15
  round 3 hole 2.7: 4(0,0)
Pad_e16
  round 3 hole 2.7: 4(0,0)
Pad_e17
  round 3 hole 2.7: 4(0,0)
Pad_e18
  round 3 hole 2.7: 4(0,0)
Pad_e19
  round 1.143 hole 1.143: 1(0,0)
Pad_e20
  round 1.143 hole 1.143: 1(0,0)
Pad_e21
  round 1.143 hole 1.143: 1(0,0)
Pad_e22
  round 1.143 hole 1.143: 1(0,0)
Pad_e23
  round 1.143 hole 1.143: 1(0,0)
Pad_e24
  round 1.143 hole 1.143: 1(0,0)
Pad_e25
  round 1.143 hole 1.143: 1(0,0)
Pad_e26
  round 1.778 hole 1.778: 1(0,0)
Pad_e27
  round 1.143 hole 1.143: 1(0,0)
Pad_e28
  round 1.143 hole 1.143: 1(0,0)
Pad_e29
  round 1.143 hole 1.143: 1(0,0)
Pad_e30
  round 1.143 hole 1.143: 1(0,0)
Pad_e31
  round 1.143 hole 1.143: 1(0,0)
Pad_e32
  round 3 hole 2.7: 4(0,0)
Pad_e33
  round 3 hole 2.7: 4(0,0)
Pad_e34
  round 2.3 hole 2.1: 3(0,0)
Pad_e35
  round 2.3 hole 2.1: 3(0,0)

## Nets
MCP2317_21: NOREF#8.4
Q1_2: NOREF#23.4

Pads without a net: NOREF 1; NOREF#2 4; NOREF#3 1; NOREF#4 3; NOREF#5 1; NOREF#6 1; NOREF#7 3; NOREF#9 4; NOREF#10 1; NOREF#11 1; NOREF#12 1; NOREF#13 1; NOREF#14 4; NOREF#15 1; NOREF#16 1; NOREF#17 1; NOREF#18 4; NOREF#19 1; NOREF#20 1; NOREF#21 3; NOREF#22 3

## Text on the board
Top Silkscreen Layer: sound>off | power>on | TBHandheld
